# Altium schematic sheet MotorDriver.SchDoc
size A; SheetNumber: 5
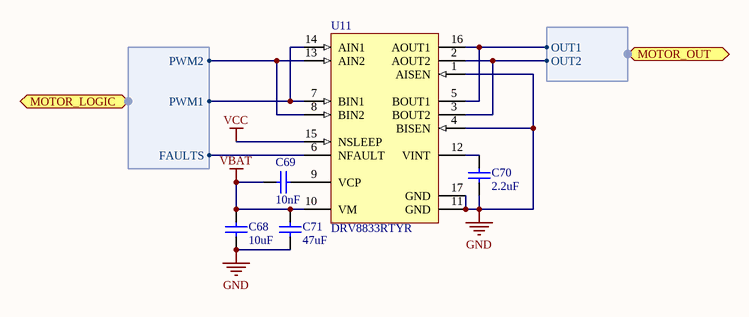
[diagram p0: MotorDriver.SchDoc]

## Parts
C68  value 10uF  [C0603[1608X92]]  (hidden comment: 10uF 16V 0603)
C69  value 10nF  [C0402[1005X55]]  (hidden comment: 10nF 50V 0402)
C70  value 2.2uF  [C0402[1005X55]]  (hidden comment: 2.2uF 6.3V 0402)
C71  value 47uF  [C1206[3216X160]]  (hidden comment: 47uF 6.3V 1206)
U11  DRV8833RTYR  [QFN-16 (0.65mm)]

## Ports
MOTOR_LOGIC (harness Motor), MOTOR_OUT (harness MotorOut)

## Harnesses
Motor: FAULTS, PWM2, PWM1
MotorOut: OUT1, OUT2

## Nets
GND: C68.1 C70.1 C71.2 U11.1(AISEN) U11.4(BISEN) U11.11(GND) U11.17(GND)
VBAT: C68.2 C69.1 C71.1 U11.10(VM)
VCC: U11.15(NSLEEP)
NetC69_2: C69.2 U11.9(VCP)
NetC70_2: C70.2 U11.12(VINT)
NetU11_2: U11.2(AOUT2) U11.3(BOUT2) ; port MOTOR_OUT.OUT2
NetU11_5: U11.5(BOUT1) U11.16(AOUT1) ; port MOTOR_OUT.OUT1
NetU11_6: U11.6(NFAULT) ; port MOTOR_LOGIC.FAULTS
NetU11_7: U11.7(BIN1) U11.14(AIN1) ; port MOTOR_LOGIC.PWM1
NetU11_8: U11.8(BIN2) U11.13(AIN2) ; port MOTOR_LOGIC.PWM2

## Library data of the parts
C68 = CAP_10uF_16V_0603_10%: 10uF 16V 10% 0603 (1608 Metric); PartNumber: GRM188R61C106KAALD; Manufacturer: Murata; Mounting Technology: Surface Mount; PackageReference: 0603; PackageDescription: 0603 (1608 Metric); Voltage: 16V; Tolerance: 10%
C69 = CAP_10nF_50V_0402_10%: 10nF 50V 10% 0402 (1005 Metric); PartNumber: GCM155R71H103KA55D; Manufacturer: Murata; Mounting Technology: Surface Mount; PackageReference: 0402; PackageDescription: 0402 (1005 Metric); Voltage: 50V; Tolerance: 10%
C70 = CAP_2.2uF_6.3V_0402_20%: 2.2uF 6.3V 20% 0402 (1005 Metric); PartNumber: GRM155R60J225ME15D; Manufacturer: Murata; Mounting Technology: Surface Mount; PackageReference: 0402; PackageDescription: 0402 (1005 Metric); Voltage: 6.3V; Tolerance: 20%
C71 = CAP_47uF_6.3V_1206_10%: 47uF 6.3V 10% 1206 (3216 Metric); PartNumber: GRM31CR60J476KE19L; Manufacturer: Murata; Mounting Technology: Surface Mount; PackageReference: 1206; PackageDescription: 1206 (3216 Metric); Voltage: 6.3V; Tolerance: 10%
U11 = DRV8833RTYR: Manufacturer: Texas Instruments; Mounting Technology: Surface Mount; PartNumber: DRV8833RTYR; PackageReference: QFN-16